# EAGLE schematic Quadcopter.koala (EAGLE 9.2.2)
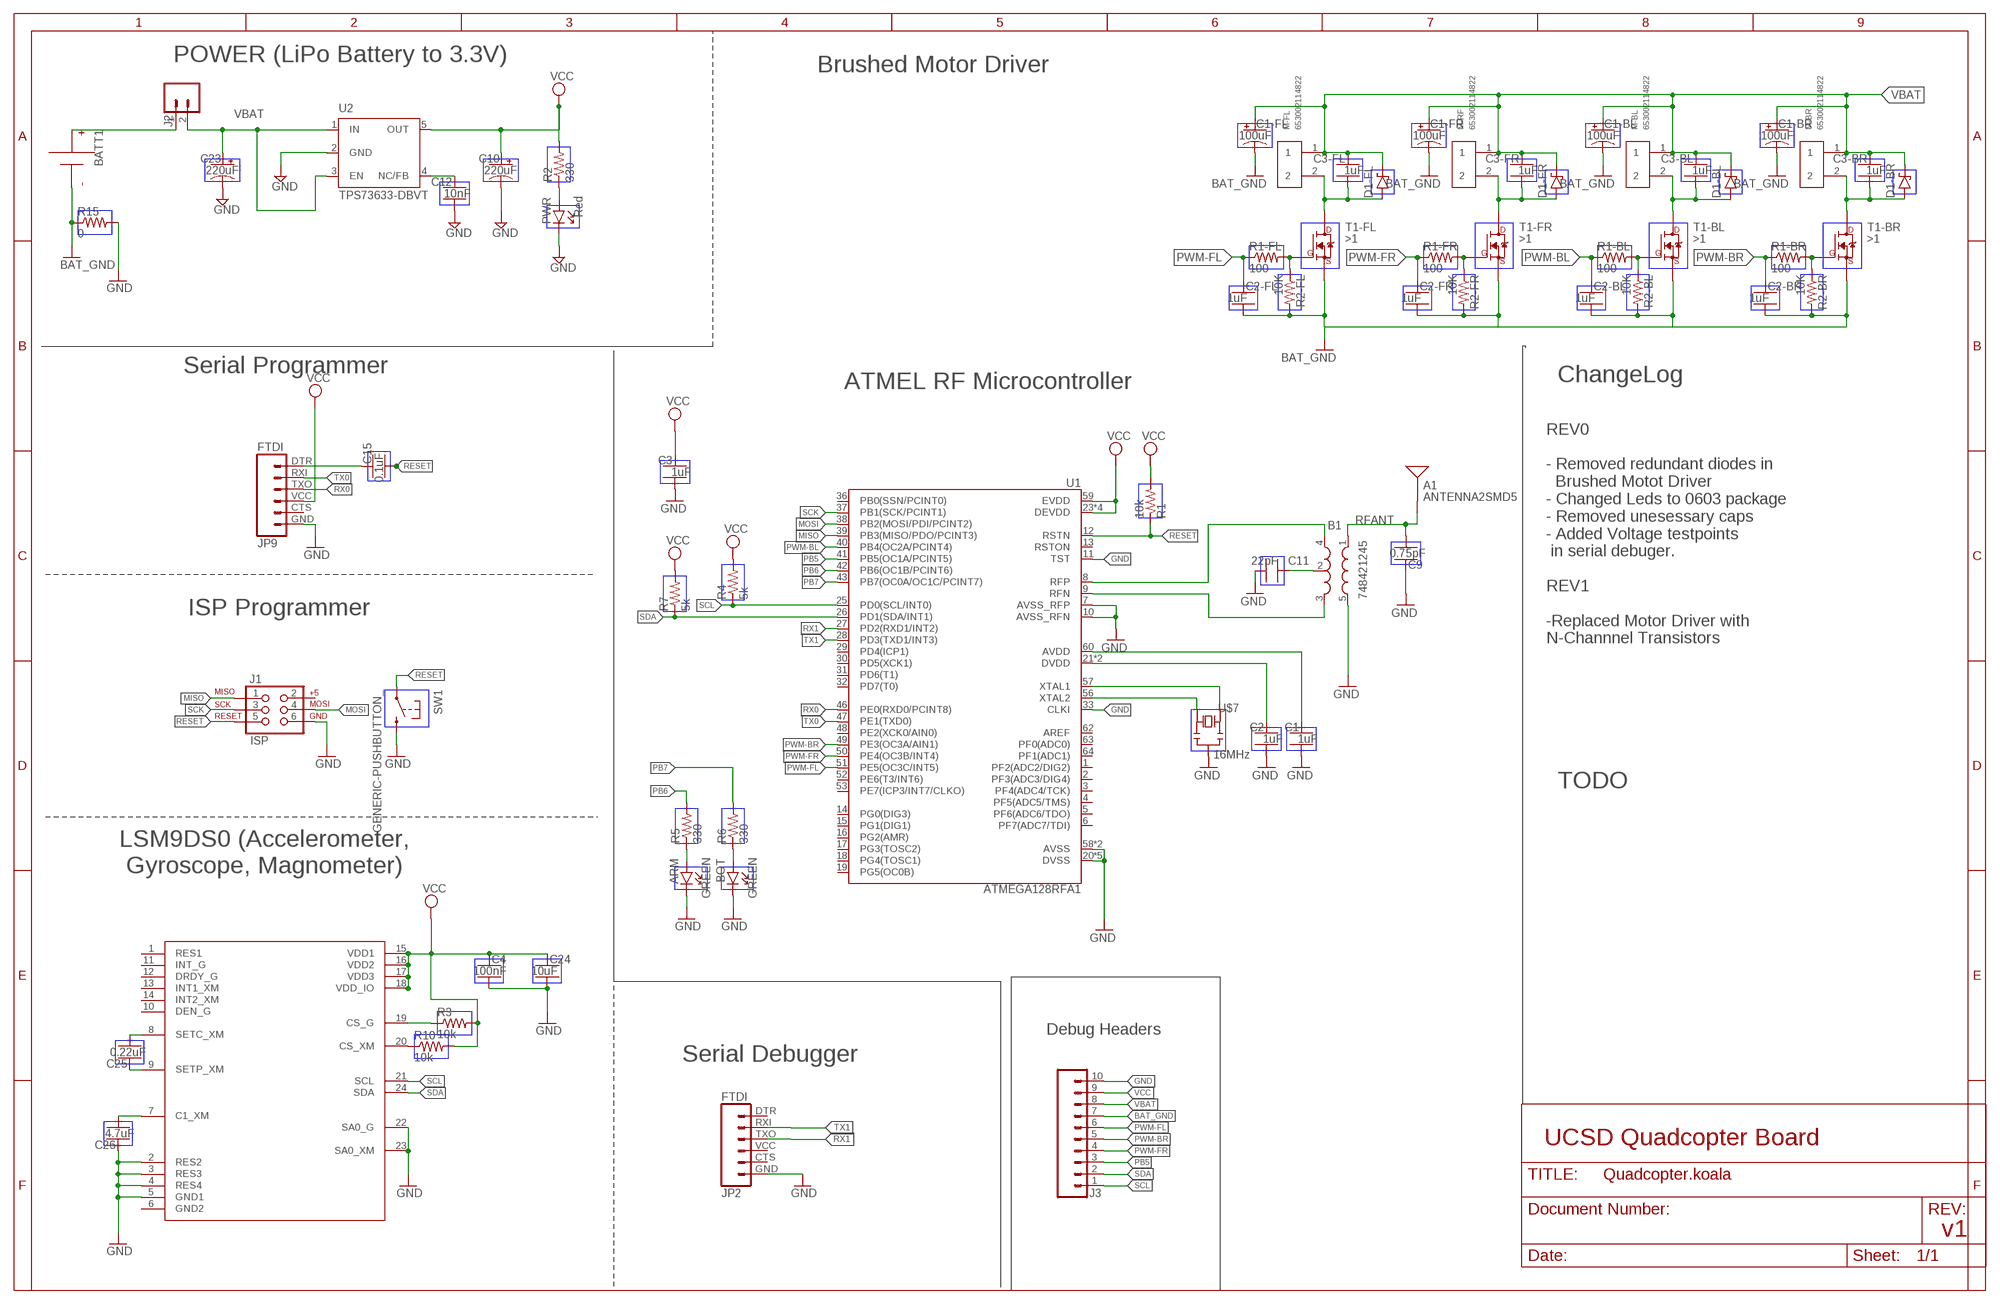
[diagram p0: schematic, sheet 1]

## Parts
A1  ANTENNA2SMD5  [ANTENNA-CHIP5]
ARM  GREEN  GENERIC-DIODE-LED_  (no package)
B1  748421245  BALUN0805  [BALUN]
BATT1  BATTERY-HUBSAN-W/HOLDER  [BATTERY-W/HOLDER-380MAH-HUBSAN]
BOT  GREEN  GENERIC-DIODE-LED_  (no package)
C1  1uF  GENERIC-CAPACITOR-NP_  (no package)
C1-BL  100uF  GENERIC-CAPACITOR-POL_  (no package)
C1-BR  100uF  GENERIC-CAPACITOR-POL_  (no package)
C1-FL  100uF  GENERIC-CAPACITOR-POL_  (no package)
C1-FR  100uF  GENERIC-CAPACITOR-POL_  (no package)
C2  1uF  GENERIC-CAPACITOR-NP_  (no package)
C2-BL  1uF  GENERIC-CAPACITOR-NP_  (no package)
C2-BR  1uF  GENERIC-CAPACITOR-NP_  (no package)
C2-FL  1uF  GENERIC-CAPACITOR-NP_  (no package)
C2-FR  1uF  GENERIC-CAPACITOR-NP_  (no package)
C3  1uF  GENERIC-CAPACITOR-NP_  (no package)
C3-BL  1uF  GENERIC-CAPACITOR-NP_  (no package)
C3-BR  1uF  GENERIC-CAPACITOR-NP_  (no package)
C3-FL  1uF  GENERIC-CAPACITOR-NP_  (no package)
C3-FR  1uF  GENERIC-CAPACITOR-NP_  (no package)
C4  100nF  GENERIC-CAPACITOR-NP_  (no package)
C9  0.75pF  GENERIC-CAPACITOR-NP_  (no package)
C10  220uF  GENERIC-CAPACITOR-POL_  (no package)
C11  22pF  GENERIC-CAPACITOR-NP_  (no package)
C12  10nF  GENERIC-CAPACITOR-NP_  (no package)
C15  0.1uF  GENERIC-CAPACITOR-NP_  (no package)
C23  220uF  GENERIC-CAPACITOR-POL_  (no package)
C24  10uF  GENERIC-CAPACITOR-NP_  (no package)
C25  0.22uF  GENERIC-CAPACITOR-NP_  (no package)
C26  4.7uF  GENERIC-CAPACITOR-NP_  (no package)
D1-BL  GENERIC-DIODE-SCHOTTKY_  (no package)
D1-BR  GENERIC-DIODE-SCHOTTKY_  (no package)
D1-FL  GENERIC-DIODE-SCHOTTKY_  (no package)
D1-FR  GENERIC-DIODE-SCHOTTKY_  (no package)
J1  ISP  AVR_SPI_PRG_6NS  [2X3-NS]
J2  _BASE-SIP-2_TH-254X2  [HDRV2W63P254_2X1_508X254H838_HS]
J3  RESOLVED-SIP-10_TH-254X10  [HDRV10W63P254_10X1_2540X254H838_HS]
JP2  FTDI  FTDI_BASICPTH  [FTDI_BASIC]
JP9  FTDI  FTDI_BASICPTH  [FTDI_BASIC]
M-BL  653002114822  [653002114822]
M-BR  653002114822  [653002114822]
M-FL  653002114822  [653002114822]
M-RF  653002114822  [653002114822]
PWR  Red  GENERIC-DIODE-LED_  (no package)
R1  10k  GENERIC-RESISTOR_  (no package)
R1-BL  100  GENERIC-RESISTOR_  (no package)
R1-BR  100  GENERIC-RESISTOR_  (no package)
R1-FL  100  GENERIC-RESISTOR_  (no package)
R1-FR  100  GENERIC-RESISTOR_  (no package)
R2  330  GENERIC-RESISTOR_  (no package)
R2-BL  10K  GENERIC-RESISTOR_  (no package)
R2-BR  10K  GENERIC-RESISTOR_  (no package)
R2-FL  10K  GENERIC-RESISTOR_  (no package)
R2-FR  10K  GENERIC-RESISTOR_  (no package)
R3  10k  GENERIC-RESISTOR_  (no package)
R4  5k  GENERIC-RESISTOR_  (no package)
R5  330  GENERIC-RESISTOR_  (no package)
R6  330  GENERIC-RESISTOR_  (no package)
R7  5k  GENERIC-RESISTOR_  (no package)
R10  10k  GENERIC-RESISTOR_  (no package)
R15  0  GENERIC-RESISTOR_  (no package)
SW1  GENERIC-PUSHBUTTON_  (no package)
T1-BL  >1  GENERIC-MOSFET-N_  (no package)
T1-BR  >1  GENERIC-MOSFET-N_  (no package)
T1-FL  >1  GENERIC-MOSFET-N_  (no package)
T1-FR  >1  GENERIC-MOSFET-N_  (no package)
U1  ATMEGA128RFA1  [QFN-64]
U2  TPS73633-DBVT  [SOT23-DBV]
U4  LSM9DS0  [LGA-24]
U$7  16MHz  GENERIC-RESONATOR_  (no package)

## Nets
AVDD [RFSIG]: C1.1 U1.60(AVDD)
BAT_GND [HIGHCURRENT]: BATT1.-(N) C1-BL.- C1-BR.- C1-FL.- C1-FR.- C2-BL.2 C2-BR.2 C2-FL.2 C2-FR.2 J3.7 R2-BL.2 R2-BR.2 R2-FL.2 R2-FR.2 R15.1 T1-BL.S T1-BR.S T1-FL.S T1-FR.S
DTR: C15.1 JP9.DTR
DVDD: C2.1 U1.21(DVDD) U1.22(DVDD)
GND: ARM.C B1.5(GND) BOT.C C1.2 C2.2 C3.2 C4.2 C9.1 C10.- C11.2 C12.2 C23.- C24.2 C26.1 J1.6 J3.10 JP2.GND JP9.GND PWR.C R15.2 SW1.2 U1.7(AVSS_RFP) U1.10(AVSS_RFN) U1.11(TST) U1.20(DVSS) U1.24(DVSS) U1.33(CLKI) U1.35(DVSS) U1.45(DVSS) U1.55(DVSS) U1.58(AVSS) U1.61(AVSS) U2.2(GND) U4.2(RES2) U4.3(RES3) U4.4(RES4) U4.5(GND1) U4.22(SA0_G) U4.23(SA0_XM) U$7.GND
MISO: J1.1 U1.39(PB3(MISO/PDO/PCINT3))
MOSI: J1.4 U1.38(PB2(MOSI/PDI/PCINT2))
N$1: C12.1 U2.4(NC/FB)
N$2: PWR.A R2.1
N$3: U1.57(XTAL1) U$7.OSC2
N$4: U1.56(XTAL2) U$7.OSC1
N$5: R1-BR.2 R2-BR.1 T1-BR.G
N$6: R1-BL.2 R2-BL.1 T1-BL.G
N$7 [RFSIG]: B1.2(GND) C11.1
N$8: ARM.A R5.1
N$9: R1-FR.2 R2-FR.1 T1-FR.G
N$10: R1-FL.2 R2-FL.1 T1-FL.G
N$13: BOT.A R6.1
N$15 [HIGHCURRENT]: BATT1.+(P) J2.1
N$20: C26.2 U4.7(C1_XM)
N$21: C25.2 U4.8(SETC_XM)
N$22: C25.1 U4.9(SETP_XM)
N$23: R3.1 U4.19(CS_G)
N$24: R10.1 U4.20(CS_XM)
N$29 [HIGHCURRENT]: C3-FL.2 D1-FL.A M-FL.2 T1-FL.D
N$30 [HIGHCURRENT]: C3-FR.2 D1-FR.A M-RF.2 T1-FR.D
N$31 [HIGHCURRENT]: C3-BL.2 D1-BL.A M-BL.2 T1-BL.D
N$32 [HIGHCURRENT]: C3-BR.2 D1-BR.A M-BR.2 T1-BR.D
PB5: J3.3 U1.41(PB5(OC1A/PCINT5))
PB6: R5.2 U1.42(PB6(OC1B/PCINT6))
PB7: R6.2 U1.43(PB7(OC0A/OC1C/PCINT7))
PWM-BL: C2-BL.1 R1-BL.1 U1.40(PB4(OC2A/PCINT4))
PWM-BR: C2-BR.1 J3.5 R1-BR.1 U1.49(PE3(OC3A/AIN1))
PWM-FL: C2-FL.1 J3.6 R1-FL.1 U1.51(PE5(OC3C/INT5))
PWM-FR: C2-FR.1 J3.4 R1-FR.1 U1.50(PE4(OC3B/INT4))
RESET: C15.2 J1.5 R1.1 SW1.1 U1.12(RSTN)
RFANT [RFSIG]: A1.FEED(SIGNAL) B1.1(IN) C9.2
RFN: B1.3(OUT2) U1.9(RFN)
RFP [RFSIG]: B1.4(OUT1) U1.8(RFP)
RX0: JP9.TXO U1.46(PE0(RXD0/PCINT8))
RX1: JP2.TXO U1.27(PD2(RXD1/INT2))
SCK: J1.3 U1.37(PB1(SCK/PCINT1))
SCL: J3.1 R4.1 U1.25(PD0(SCL/INT0)) U4.21(SCL)
SDA: J3.2 R7.1 U1.26(PD1(SDA/INT1)) U4.24(SDA)
TX0: JP9.RXI U1.47(PE1(TXD0))
TX1: JP2.RXI U1.28(PD3(TXD1/INT3))
VBAT [HIGHCURRENT]: C1-BL.+ C1-BR.+ C1-FL.+ C1-FR.+ C3-BL.1 C3-BR.1 C3-FL.1 C3-FR.1 C23.+ D1-BL.C D1-BR.C D1-FL.C D1-FR.C J2.2 J3.8 M-BL.1 M-BR.1 M-FL.1 M-RF.1 U2.1(IN) U2.3(EN)
VCC: C3.1 C4.1 C10.+ C24.1 J3.9 JP9.VCC R1.2 R2.2 R3.2 R4.2 R7.2 R10.2 U1.23(DEVDD) U1.34(DEVDD) U1.44(DEVDD) U1.54(DEVDD) U1.59(EVDD) U2.5(OUT) U4.15(VDD1) U4.16(VDD2) U4.17(VDD3) U4.18(VDD_IO)
Unconnected: J1.2 JP2.CTS JP2.DTR JP2.VCC JP9.CTS U1.1(PF2(ADC2/DIG2)) U1.2(PF3(ADC3/DIG4)) U1.3(PF4(ADC4/TCK)) U1.4(PF5(ADC5/TMS)) U1.5(PF6(ADC6/TDO)) U1.6(PF7(ADC7/TDI)) U1.13(RSTON) U1.14(PG0(DIG3)) U1.15(PG1(DIG1)) U1.16(PG2(AMR)) U1.17(PG3(TOSC2)) U1.18(PG4(TOSC1)) U1.19(PG5(OC0B)) U1.29(PD4(ICP1)) U1.30(PD5(XCK1)) U1.31(PD6(T1)) U1.32(PD7(T0)) U1.36(PB0(SSN/PCINT0)) U1.48(PE2(XCK0/AIN0)) U1.52(PE6(T3/INT6)) U1.53(PE7(ICP3/INT7/CLKO)) U1.62(AREF) U1.63(PF0(ADC0)) U1.64(PF1(ADC1)) U4.1(RES1) U4.6(GND2) U4.10(DEN_G) U4.11(INT_G) U4.12(DRDY_G) U4.13(INT1_XM) U4.14(INT2_XM)

## Notes on the sheet
- POWER (LiPo Battery to 3.3V)
- Brushed Motor Driver
- Serial Programmer
- ATMEL RF Microcontroller | ChangeLog
- ISP Programmer
- REV0
  
  - Removed redundant diodes in 
    Brushed Motot Driver
  - Changed Leds to 0603 package
  - Removed unesessary caps
  - Added Voltage testpoints
   in serial debuger.
  
  REV1
  
  -Replaced Motor Driver with 
  N-Channnel Transistors
- TODO
- LSM9DS0 (Accelerometer,
   Gyroscope, Magnometer)
- Debug Headers
- Serial Debugger
- UCSD Quadcopter Board
- v1

## Library data of the parts
A1 = SparkFun-RF:ANTENNA2: Chip antenna Single endded antenna. Common with smaller chip antennas. CHIP4 package is the GPS Chip Antenna SKU: GPS-08418. CHIP5 package is 2.4GHz chip antenna SKU: WRL-00144.
ARM BOT PWR = KoalaDesign:GENERIC-DIODE-LED_: Light emitting diode
B1 = SparkFun-RF:BALUN: 0805 footprint balun- Ember 351/357
BATT1 = Components:BATTERY: AAA PC pin holder Mouser part #12BH412 - but pretty much any 1x AAA battery holder should be the same http://www.ladyada.net/library/pcb/eaglelibrary.html
C1 C2 C2-BL C2-BR C2-FL C2-FR C3 C3-BL C3-BR C3-FL C3-FR C4 C9 C11 C12 C15 C24-C26 = KoalaDesign:GENERIC-CAPACITOR-NP_: Nonpolarized capacitor
C1-BL C1-BR C1-FL C1-FR C10 C23 = KoalaDesign:GENERIC-CAPACITOR-POL_: Polarized capacitor
D1-BL D1-BR D1-FL D1-FR = KoalaDesign:GENERIC-DIODE-SCHOTTKY_: Schottky diode
J1 = Controller:AVR_SPI_PRG_6: AVR ISP 6 Pin This is the reduced ISP connector for AVR programming. Common on Arduino. This footprint will take up less PCB space and can be used with a 10-pin to 6-pin adapter such as SKU: BOB-08508
J2 = NVSL:_BASE-SIP-2_: 2 pin single inline pin header, socket, or connector
J3 = KoalaBuild:RESOLVED-SIP-10_: 10 pin single inline pin header, socket, or connector
JP2 JP9 = SparkFun-Connectors:FTDI_BASIC: FTDI Basic header with labels
M-BL M-BR M-FL M-RF = Wuerth_Elektronik_eiCan_Wire_to_Board_Connectors:653002114822: WR-WTB 1.25mm Male Vertical Shrouded Header, 2 Pins=>Code : Con_WTB_1.25_PCB_THT_653002114822 <http://katalog.we-online.de/media/thumbs2/eican/thb_Con_WTB_1.25_PCB_THT_6530xx114822_pf2.jpg> Details see: http://katalog.we-online.de/en/em/653_0xx_114_822 Created 2014-06-06, Karrer Zheng 2014 (C) Würth Elektronik; OC_FARNELL: unknown
R1 R1-BL R1-BR R1-FL R1-FR R2 R2-BL R2-BR R2-FL R2-FR R3-R7 R10 R15 = KoalaDesign:GENERIC-RESISTOR_: Resistor
SW1 = KoalaDesign:GENERIC-PUSHBUTTON_: Pushbutton with 2 pins shorting 1 to 2 and two extra mounting pins 3 & 4
T1-BL T1-BR T1-FL T1-FR = KoalaDesign:GENERIC-MOSFET-N_: Generic N-Channel MOSFET
U1 = UCSD_QuadCopter_Rev1 copy:ATMEGA128RFA1: ATmega128RFA1 8-bit AVR Microcontroller with Low Power 2.4GHz Transceiver for ZigBee and IEEE 802.15.4
U2 = Power:TPS73633-DBVT
U4 = Controller:LSM9DS0: IMU
U$7 = KoalaDesign:GENERIC-RESONATOR_: Resonator (crystal with the caps)

## Net classes
1 RFSIG: width 0.457 mm, clearance 0.205 mm to class 0, clearance 0.205 mm
2 HIGHCURRENT: width 0.457 mm